# Altium project ECE453-F22-MCU.PrjPcb (part 2 of 3)

## Sheet 03_Power_Delivery.SchDoc
size A
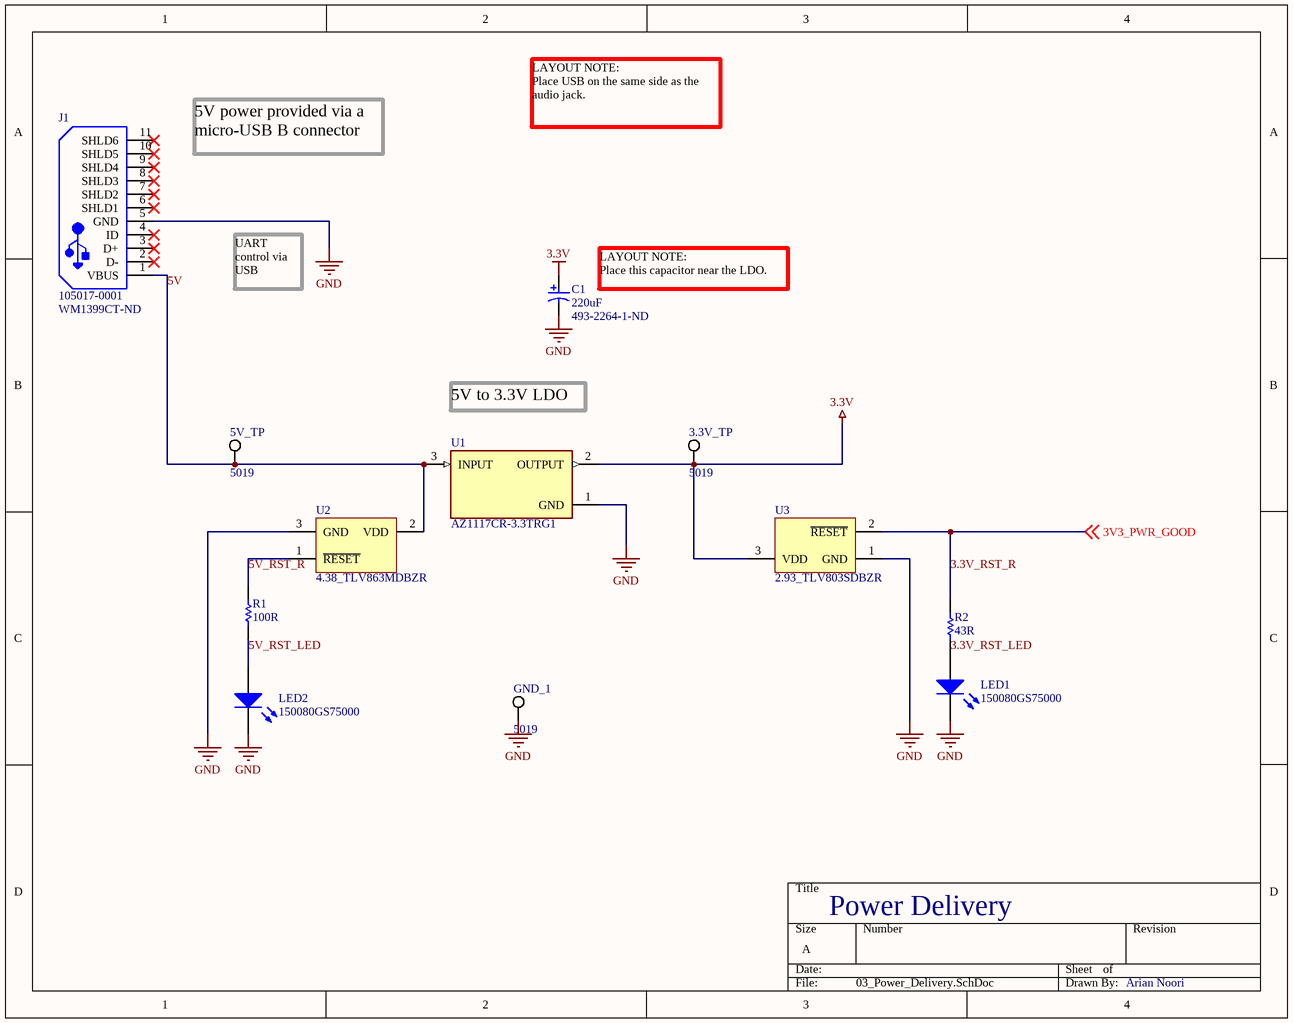
[diagram p2: 03_Power_Delivery.SchDoc]

### Parts
3.3V_TP  5019  [KSTN-5019_V]
5V_TP  5019  [KSTN-5019_V]
C1  220uF  Supplier Part Number 1: 493-2264-1-ND  [NIC-CAPA2-6.3X7.7_V]
GND_1  5019  [KSTN-5019_V]
J1  105017-0001  Supplier Part Number 1: WM1399CT-ND  [USB-MICRO-B_V]
LED1  150080GS75000  [0805_A]
LED2  150080GS75000  [0805_A]
R1  100R  [RESC2013X60X35ML10T20]
R2  43R  [RESC2013X60X35LL10T20]
U1  AZ1117CR-3.3TRG1  [FP-SOT89-MFG]
U2  4.38_TLV863MDBZR  [DBZ0003A_N]
U3  2.93_TLV803SDBZR  [DBZ0003A_M]

### Nets
3.3V: 3.3V_TP.1 C1.1 U1.2(OUTPUT) U3.3(VDD)
GND: C1.2 GND_1.1 J1.5(GND) LED1.1(K) LED2.1(K) U1.1(GND) U2.3(GND) U3.1(GND)
3.3V_RST_LED: LED1.2(A) R2.1
3.3V_RST_R: R2.2 U3.2(~{RESET}) ; off-sheet 3V3_PWR_GOOD  [also labelled 3V3_PWR_GOOD]
5V: 5V_TP.1 J1.1(VBUS) U1.3(INPUT) U2.2(VDD)
5V_RST_LED: LED2.2(A) R1.1
5V_RST_R: R1.2 U2.1(~{RESET})

Not connected (* = marked no-connect by the designer): J1 2(D-)* 3(D+)* 4(ID)* 6(SHLD1)* 7(SHLD2)* 8(SHLD3)* 9(SHLD4)* 10(SHLD5)* 11(SHLD6)*

### Notes on the sheet
- 5V power provided via a micro-USB B connector
- LAYOUT NOTE:
  Place USB on the same side as the audio jack.
- UART control via USB
- (near C1) LAYOUT NOTE:
  Place this capacitor near the LDO.
- 5V to 3.3V LDO
- Power Delivery
- Arian Noori

### Library data of the parts
3.3V_TP 5V_TP GND_1 = CMP-1672-00008-1: Test Point, 1 Position SMD, RoHS, Tape and Reel; Manufacturer: Keystone Electronics; ComponentLink1Description: Manufacturer URL; Package Quantity: 1000; DatasheetVersion: 03/2014; Packaging: Tape and Reel; ComponentLink2URL: http://www.keyelco.com/product-pdf.cfm?p=1357; ComponentLink1URL: http://www.keyelco.com/; Mount: Surface Mount; Contact Plating: Silver; PackageDescription: 1-Pin Surface Mount Device, Body 3.81 x 2.03 mm; Pins: 1; RoHSCompliant: True; Mounting Technology: Surface Mount; ComponentLink2Description: Datasheet; PackageReference: 5019; Supplier 1: Digi-Key; Manufacturer Part Number: 5019; RoHS: Yes; Category: Connectors; Stock 1: 1306897; Pricing 1: 1=0.34000, 25=0.27360, 100=0.22340, 250=0.20064, 500=0.19152 (USD); Number of Pins: 1; Material: Bronze; Contact Material: Bronze; Termination: SMD/SMT; Series: 5019; Height: 0.09inch; REACH SVHC: No SVHC; RoHS Compliant: Yes; Lead Free: Lead Free; ComponentLink3URL: https://datasheet.ciiva.com/16318/m60-2p61-16318395.pdf?src-supplier=Future+Electronics; ComponentLink3Description: https://datasheet.ciiva.com/16318/m60-2p61-16318395.pdf?src-supplier=Future+Electronics; ComponentLink4URL: https://datasheet.ciiva.com/16885/70182998-16885945.pdf?src-supplier=Allied+Electronics; ComponentLink4Description: https://datasheet.ciiva.com/16885/70182998-16885945.pdf?src-supplier=Allied+Electronics; ComponentLink5URL: https://datasheet.ciiva.com/14848/m60-2p61-14848437.pdf?src-supplier=Digi-Key; ComponentLink5Description: https://datasheet.ciiva.com/14848/m60-2p61-14848437.pdf?src-supplier=Digi-Key; ComponentLink6URL: https://datasheet.ciiva.com/14848/m60-2p61-14848438.pdf?src-supplier=Digi-Key; ComponentLink6Description: https://datasheet.ciiva.com/14848/m60-2p61-14848438.pdf?src-supplier=Digi-Key; ComponentLink7URL: https://datasheet.ciiva.com/14848/m60-2p61-14848439.pdf?src-supplier=Digi-Key; ComponentLink7Description: https://datasheet.ciiva.com/14848/m60-2p61-14848439.pdf?src-supplier=Digi-Key
C1 = CMP-0687-00060-1: Aluminum Electrolytic Capacitor, UD Series, Low Impedance, 220 uF, 16 V, + / - 20%, -55 to 105 degC, Chip Type, 6.3 x 7.7 mm D x L, Pb-Free, Reel; PartNumber: UUD1C221MCL1GS; Manufacturer: Nichicon; Impedance: 0.34 Ohm; Tolerance Rated Capacitance: -20 to 20%; Rated Voltage: 16 V; Endurance Time: 2000 h; Rated Ripple Current (at 100kHz): 280 mA; Packing: Dia382mm Reel; Description: Aluminum Electrolytic Capacitor, 220uF 16 V, UD Series 2000h 6.3 (Dia.) x 7.7mm; Dielectric Material: Aluminium; Ripple Current: 280mA; Voltage Rating (DC): 16V; Leakage Current: 3uA; Life (Hours): 2000Hour; Dissipation Factor: 0.2%; Lead Diameter: 0.8mm; PackageReference: CAPAE-D6.3H7.7; DatasheetVersion: 08/2012; Rated Capacitance: 220 uF; ComponentLink1URL: http://www.nichicon.co.jp/; ComponentLink3URL: http://products.nichicon.co.jp/en/pdf/XJA043/e-ud.pdf; PackageDescription: 2-Pin Surface Mount Device, Diameter 6.3 mm, Height 7.7 mm, Pitch 5.4 mm; ComponentLink3Description: Package Specification; Length: 7.7 mm; RoHS: TRUE; Mounting Technology: Surface Mount; ComponentLink2Description: Datasheet; ComponentLink2URL: http://products.nichicon.co.jp/en/pdf/XJA043/e-ud.pdf; Diameter: 6.3 mm; ComponentLink1Description: Manufacturer URL; Supplier 1: Digi-Key; Manufacturer Part Number: UUD1C221MCL1GS; Category: Aluminum Electrolytic Capacitors; Stock 1: 25833; Pricing 1: 1=0.46000, 10=0.32000, 50=0.22420, 100=0.19220 (USD); Case/Package: Radial; Number of Pins: 2; Min Operating Temperature: -55°C; Max Operating Temperature: 105°C; Tolerance: 20%; Ripple Current (AC): 280mA; Package Quantity: 1; Packaging: Tape and Reel; Capacitance: 220uF; Voltage Rating: 16V; Termination: SMD/SMT; Voltage: 16V; Series: UD; Construction: Cylindrical; Height: 7.7mm; Lead Pitch: 2.2mm; Height - Seated (Max): 0.303inch; Radiation Hardening: No; REACH SVHC: No SVHC; Lead Free: Lead Free; RoHS Compliant: Yes; ComponentLink4URL: https://datasheet.ciiva.com/97/e-ud-97205.pdf?src-supplier=Digi-Key; ComponentLink4Description: https://datasheet.ciiva.com/97/e-ud-97205.pdf?src-supplier=Digi-Key; ComponentLink5URL: https://datasheet.ciiva.com/97/e-ud-97206.pdf?src-supplier=Digi-Key; ComponentLink5Description: https://datasheet.ciiva.com/97/e-ud-97206.pdf?src-supplier=Digi-Key; ComponentLink6URL: https://datasheet.ciiva.com/97/e-ud-97207.pdf?src-supplier=Digi-Key; ComponentLink6Description: https://datasheet.ciiva.com/97/e-ud-97207.pdf?src-supplier=Digi-Key; ComponentLink7URL: https://datasheet.ciiva.com/11685/e-ud-11685974.pdf?src-supplier=Avnet; ComponentLink7Description: https://datasheet.ciiva.com/11685/e-ud-11685974.pdf?src-supplier=Avnet; ComponentLink8URL: https://datasheet.ciiva.com/5361/e-ud-5361934.pdf?src-supplier=Mouser; ComponentLink8Description: https://datasheet.ciiva.com/5361/e-ud-5361934.pdf?src-supplier=Mouser; ComponentLink9URL: https://datasheet.ciiva.com/16373/e-ud-16373647.pdf?src-supplier=Future+Electronics; ComponentLink9Description: https://datasheet.ciiva.com/16373/e-ud-16373647.pdf?src-supplier=Future+Electronics; ComponentLink10URL: https://datasheet.ciiva.com/7781/e-ud-7781693.pdf?src-supplier=Element14; ComponentLink10Description: https://datasheet.ciiva.com/7781/e-ud-7781693.pdf?src-supplier=Element14
J1 = CMP-2000-05827-1: Micro-USB B Receptacle, Right Angle, Bottom Mount, Surface Mount, with Solder Tabs, -30 to 85 degC, 5-Pin USB, RoHS, Tape and Reel; Manufacturer: Molex; Featured Product: Micro-USBConnectorsUSBConnectors; Other Names: WM1399DKR; Package Version: Rev. F, 12/2012; Number of Contacts: 5; Connector Type: USB-microB; Catalog Drawings: 1050170001; 3D Model: 105017-0001.stp; Mating Products: WM17145-ND-CABLEMICROUSBBTOSTDA1.0MWM17147-ND-CABLEMICROUSBBTOSTDA2.0MWM17146-ND-CABLEMICROUSBBTOSTDA1.5M; PCN Assembly/Origin: ResinSupplier21/Oct/2015; Voltage - Max: 30V; Online Catalog: Molex-MicroUSB; USB Standard: USB 2.0; Current Rating: 1.8A; Number of Ports: 1; Mating Cycles: 10000; Shielding: Shielded; Pitch: 0.65mm; Manufacturer URL: http://www.molex.com/; Package Description: 5-Leads USB, Micro B, Body 7.5 x 5 mm, Pitch 0.65 mm; Datasheet URL: http://www.molex.com/elqNow/elqRedir.htm?ref=http://www.molex.com/webdocs/datasheets/pdf/en-us/1050170001_IO_CONNECTORS.pdf; Ingress Protection: -; Datasheet Version: 03/2016; Mounting Type: BoardCutout,SurfaceMount,RightAngle; Circuits: 5; Standard Package: 1; Package Reference: MICRO-B; Package URL: http://www.molex.com/pdm_docs/sd/1050170001_sd.pdf; Category: Connectors,Interconnects; Series: -; RoHS Information: 1050170001CertofCompliance; Features: Shielded,SolderRetention; Family: USB,DVI,HDMIConnectors; Specifications: -; Gender: Receptacle; Packaging: Digi-Reel®; Mounting Technology: SurfaceMount; Supplier 1: Digi-Key; Manufacturer Part Number: 1050170001; RoHS: Yes; Stock 1: 49105; Pricing 1: 1=1.01000, 10=0.84000, 100=0.69990, 1000=0.55994 (USD); Mount: Surface Mount,Through Hole,Horizontal; Contact Plating: Gold; Contact Material: Copper Alloy,Copper; Number of Terminals/Pins: 5; Housing Material: Polymer; Insulation Color: Black; Min Operating Temperature: -30°C; Max Operating Temperature: 85°C; Orientation: Right Angle; Termination: Solder; Voltage Rating (AC): 30V; Max Voltage Rating (AC): 30V; Voltage Rating: 30V; Package Quantity: 2000; Number of Positions: 5; Number of Circuits: 5; Length: 8.2mm; Depth: 7.5mm; Radiation Hardening: No; REACH SVHC: Unknown; RoHS Compliant: Yes; Flammability Rating: UL94 V-0; Halogen Free: Low Halogen; ComponentLink1URL: https://datasheet.ciiva.com/30165/235271050170001-io-nectors-30165183.pdf?src-supplier=Onlinecomponents.com; ComponentLink1Description: https://datasheet.ciiva.com/30165/235271050170001-io-nectors-30165183.pdf?src-supplier=Onlinecomponents.com; ComponentLink2URL: https://datasheet.ciiva.com/8015/1631959-8015288.pdf?src-supplier=Element14; ComponentLink2Description: https://datasheet.ciiva.com/8015/1631959-8015288.pdf?src-supplier=Element14; ComponentLink3URL: https://datasheet.ciiva.com/22654/1688140-22654924.pdf?src-supplier=Element14; ComponentLink3Description: https://datasheet.ciiva.com/22654/1688140-22654924.pdf?src-supplier=Element14; ComponentLink4URL: https://datasheet.ciiva.com/3094/1050170001-io-connectors-3094416.pdf?src-supplier=Avnet; ComponentLink4Description: https://datasheet.ciiva.com/3094/1050170001-io-connectors-3094416.pdf?src-supplier=Avnet; ComponentLink5URL: https://datasheet.ciiva.com/4598/1050170001-io-connectors-152207-4598759.pdf?src-supplier=Mouser; ComponentLink5Description: https://datasheet.ciiva.com/4598/1050170001-io-connectors-152207-4598759.pdf?src-supplier=Mouser; ComponentLink6URL: https://datasheet.ciiva.com/851/1050170001-sd-851276.pdf?src-supplier=Digi-Key; ComponentLink6Description: https://datasheet.ciiva.com/851/1050170001-sd-851276.pdf?src-supplier=Digi-Key; ComponentLink7URL: https://datasheet.ciiva.com/851/1050170001-sd-851277.pdf?src-supplier=Digi-Key; ComponentLink7Description: https://datasheet.ciiva.com/851/1050170001-sd-851277.pdf?src-supplier=Digi-Key; ComponentLink8URL: https://datasheet.ciiva.com/851/1050170001-sd-851278.pdf?src-supplier=Digi-Key; ComponentLink8Description: https://datasheet.ciiva.com/851/1050170001-sd-851278.pdf?src-supplier=Digi-Key; ComponentLink9URL: https://datasheet.ciiva.com/16668/1050170001-io-connectors-16668598.pdf?; ComponentLink9Description: https://datasheet.ciiva.com/16668/1050170001-io-connectors-16668598.pdf?
LED1 LED2 = CMP-1426-00007-1: SMD mono-color Chip LED, WL-SMCW, Green; Manufacturer: Wuerth Elektronik; Manufacturer 1: Wurth Electronics; Viewing Angle: 140°; Lens Style: Clear,Rectangular; Luminous Intensity: 450mcd; Forward Voltage: 3.2V; Wavelength: 520nm; Forward Current: 30mA; Test Current: 20mA; PackageReference: 0805_A; Color: Green; PartNumber: 150080GS75000; ComponentLink2URL: http://katalog.we-online.com/led/datasheet/150080GS75000.pdf; ComponentLink1URL: http://www.we-online.com; ComponentLink1Description: Manufacturer URL; ComponentLink2Description: Datasheet; Supplier 1: Digi-Key; Supplier Part Number 1: 732-4983-1-ND; Manufacturer Part Number 1: 150080GS75000; RoHS: Yes; Category: LEDs; Stock 1: 95801; Pricing 1: 1=0.19000, 50=0.17600, 100=0.15100, 500=0.13100 (USD); Mount: Surface Mount; Case/Package: 0805; Case Code (Metric): 2012; Case Code (Imperial): 0805; Min Operating Temperature: -40°C; Max Operating Temperature: 85°C; Package Quantity: 4000; Packaging: Cut Tape; Dominant Wavelength: 520nm; Length: 2mm; Width: 1.25mm; Height: 0.7mm; REACH SVHC: Unknown; RoHS Compliant: Yes; ComponentLink3URL: https://datasheet.ciiva.com/29563/150080gs75000-29563008.pdf?src-supplier=Digi-Key; ComponentLink3Description: https://datasheet.ciiva.com/29563/150080gs75000-29563008.pdf?src-supplier=Digi-Key; ComponentLink4URL: https://datasheet.ciiva.com/29279/759434-da-01-en-chipled-0805-w-kl-gruen-150080gs75000-29279039.pdf?src-supplier=Conrad; ComponentLink4Description: https://datasheet.ciiva.com/29279/759434-da-01-en-chipled-0805-w-kl-gruen-150080gs75000-29279039.pdf?src-supplier=Conrad
R1 = CMP-2100-03669-1: Chip Resistor, 100 Ohm, +/-1%, 0.125 W, -55 to 155 degC, 0805 (2012 Metric), RoHS, Tape and Reel; Manufacturer: Yageo; Manufacturer Part Number: RC0805FR-07100RL; Power Rating: 125mW; Resistance: 100Ohm; Voltage Rating: 150V; Tolerance: 1%; Temperature Coefficient: 100ppm/degreesC; Application(s): HIGH RELIABILITY; Length: 2mm; Package Description: 2-Pin Surface Mounted Device, Body 2 x 1.25 mm; Case Code (Imperial): 0805; Number of Pins: 2; Termination: SMD/SMT; Lead Pitch: 0.4mm; Package Quantity: 1; Height: 0.024inch; Case Code (Metric): 2012; Number of Terminations: 2; Datasheet Version: Rev. 5, 10/2016; Lead Free: LeadFree; Package Reference: 0805; Composition: ThickFilm; REACH SVHC: Unknown; Voltage Rating (DC): 150V; Min Operating Temperature: -55degC; Packaging: TapeandReel; Military Standard: Not; Case/Package: 0805; Datasheet URL: http://www.yageo.com/NewPortal/yageodocoutput?fileName=/pdf/R-Chip/PYu-RC_Group_51_RoHS_L_5.pdf; Max Operating Temperature: 155degC; Manufacturer URL: http://www.yageo.com/; Max Power Dissipation: 125mW; Width: 0.049inch; Depth: 1.25mm; RoHSCompliant: true; Supplier 1: Digi-Key; RoHS: Yes; Category: Chip SMD Resistors; Stock 1: 3207618; Pricing 1: 1=0.10000, 10=0.03700, 100=0.01510, 1000=0.00680, 2500=0.00590 (USD); Weight: 0.000917oz; Series: RC; Resistor Type: Thick Film; Technology: THICK FILM; Features: Moisture Resistant; Type: General Purpose; RoHS Compliant: Yes; ComponentLink1URL: https://datasheet.ciiva.com/11808/0900766b8106beab-11808877.pdf?src-supplier=RSComponents; ComponentLink1Description: https://datasheet.ciiva.com/11808/0900766b8106beab-11808877.pdf?src-supplier=RSComponents; ComponentLink2URL: https://datasheet.ciiva.com/7941/1697719-7941680.pdf?src-supplier=Element14; ComponentLink2Description: https://datasheet.ciiva.com/7941/1697719-7941680.pdf?src-supplier=Element14; ComponentLink3URL: https://datasheet.ciiva.com/7941/1686128-7941679.pdf?src-supplier=Element14; ComponentLink3Description: https://datasheet.ciiva.com/7941/1686128-7941679.pdf?src-supplier=Element14; ComponentLink4URL: https://datasheet.ciiva.com/7660/38627-7660797.pdf?src-supplier=Element14; ComponentLink4Description: https://datasheet.ciiva.com/7660/38627-7660797.pdf?src-supplier=Element14; ComponentLink5URL: https://datasheet.ciiva.com/22747/444164-22747535.pdf?src-supplier=Element14; ComponentLink5Description: https://datasheet.ciiva.com/22747/444164-22747535.pdf?src-supplier=Element14; ComponentLink6URL: https://datasheet.ciiva.com/46447/444164-46447562.pdf?src-supplier=Element14; ComponentLink6Description: https://datasheet.ciiva.com/46447/444164-46447562.pdf?src-supplier=Element14; ComponentLink7URL: https://datasheet.ciiva.com/2456/pyu-r-int-thick-7-2456988.pdf?src-supplier=Digi-Key; ComponentLink7Description: https://datasheet.ciiva.com/2456/pyu-r-int-thick-7-2456988.pdf?src-supplier=Digi-Key; ComponentLink8URL: https://datasheet.ciiva.com/2456/pyu-r-int-thick-7-2456989.pdf?src-supplier=Digi-Key; ComponentLink8Description: https://datasheet.ciiva.com/2456/pyu-r-int-thick-7-2456989.pdf?src-supplier=Digi-Key; ComponentLink9URL: https://datasheet.ciiva.com/2456/pyu-r-int-thick-7-2456987.pdf?src-supplier=Digi-Key; ComponentLink9Description: https://datasheet.ciiva.com/2456/pyu-r-int-thick-7-2456987.pdf?src-supplier=Digi-Key; ComponentLink10URL: https://datasheet.ciiva.com/17082/rc0805-17082697.pdf?src-supplier=Future+Electronics; ComponentLink10Description: https://datasheet.ciiva.com/17082/rc0805-17082697.pdf?src-supplier=Future+Electronics
R2 = CMP-2001-01384-1: RES 43 OHM 1/8W .5% SMD 0805; Part Number: RC0805JR-0743RL; Manufacturer: Yageo; Tolerance: 5%; Temperature Coefficient: 100ppm/°C; Max Power Dissipation: 125mW; Voltage Rating: 150V; Supplier 1: Digi-Key; Manufacturer Part Number: RC0805JR-0743RL; RoHS: Yes; Category: Chip SMD Resistors; Stock 1: 8138; Pricing 1: 1=0.10000, 10=0.03200, 100=0.01300, 1000=0.00584, 2500=0.00507 (USD); Case/Package: 0805; Case Code (Imperial): 0805; Case Code (Metric): 2012; Contact Plating: Tin,Matte; Size Code: 0805; Min Operating Temperature: -55°C; Max Operating Temperature: 155°C; Resistance: 43R; Packaging: Tape and Reel; Series: RC; Number of Terminations: 2; Power Rating: 125mW; Resistor Type: Thick Film; Termination: SMD/SMT; Voltage Rating (DC): 150V; Features: Moisture Resistant; Construction: Rectangular; Length: 2mm; Width: 1.25mm; Height: 0.5mm; Depth: 1.25mm; Radiation Hardening: No; RoHS Compliant: Yes; Lead Free: Lead Free; Military Standard: Not; ComponentLink1URL: https://datasheet.ciiva.com/12560/rc0805-257173-12560726.pdf?src-supplier=Mouser; ComponentLink1Description: https://datasheet.ciiva.com/12560/rc0805-257173-12560726.pdf?src-supplier=Mouser; ComponentLink2URL: https://datasheet.ciiva.com/16745/rc0805-16745692.pdf?src-supplier=Future+Electronics; ComponentLink2Description: https://datasheet.ciiva.com/16745/rc0805-16745692.pdf?src-supplier=Future+Electronics
U1 = CMP-12756-000007-1: IC REG LINEAR 3.3V 800MA SOT89; Manufacturer: Diodes Inc.; Nominal Supply Current: 4mA; Output Type: Fixed; Accuracy Percentage: 1%; Max Junction Temp: +125°C; Max Supply Voltage: 15V; Number Of Outputs: 1; Output Current: 1.35A; Dropout Voltage: 1.2V; Min Current Limit: 1A; Polarity: Positive; Reference Voltage: 1.262V; Power Supply Rejection Ratio (PSRR): 70dB; Device Class L1: Integrated Circuits (ICs); ComponentLink2URL: https://www.diodes.com/assets/Datasheets/AZ1117C.pdf; Temperature Range High: +125°C; Octopart: https://octopart.com/az1117cr-3.3trg1-diodes+inc.-30954805; Output Voltage: 3.3V; Automotive: No; RoHS: TRUE; Temperature Range Low: -20°C; Package: SOT89; Height: 1.6mm; Mouser Description: DiodesZetex AZ1117CR-3.3TRG1, LDO Regulator, 800mA, 3.3 V, ±1% 3-Pin, SOT-89; Manufacturer Part Number: AZ1117CR-3.3TRG1; ComponentLink2Description: Datasheet; Device Class L2: Power Management ICs; Lead Free: Yes; Device Class L3: Voltage Regulators - Linear; Category: IC; Temperature: -20°C to +125°C; Footprint Url: https://www.diodes.com/assets/Package-Files/SOT89.pdf; Digikey Description: IC REG LINEAR 3.3V 800MA SOT89; Supplier 1: Digi-Key; Stock 1: 15482; Pricing 1: 1=0.44000, 10=0.33300, 25=0.30040, 100=0.20740, 250=0.17468, 500=0.14194 (USD); Mount: Surface Mount; Case/Package: SOT-89; Number of Pins: 3; Weight: 0.004603oz; Min Operating Temperature: -20°C; Max Operating Temperature: 125°C; Max Input Voltage: 15V; Package Quantity: 1000; Packaging: Tape and Reel; Max Output Current: 1.35A; Number of Regulators: 1; Quiescent Current: 4mA; Accuracy: 1%; Length: 4.6mm; Width: 2.6mm; ComponentLink1URL: https://datasheet.ciiva.com/29568/az1117c-29568862.pdf?src-supplier=Digi-Key; ComponentLink1Description: https://datasheet.ciiva.com/29568/az1117c-29568862.pdf?src-supplier=Digi-Key; ComponentLink3URL: https://datasheet.ciiva.com/30016/az1117c-30016678.pdf?src-supplier=Avnet; ComponentLink3Description: https://datasheet.ciiva.com/30016/az1117c-30016678.pdf?src-supplier=Avnet
U2 = CMP-0332-00606-2: Voltage Supervisor with Active-Low, Open-Drain Reset, 1 Supply Monitored, -40 to 125 degC, 3-pin SOT-23 (DBZ), Green (RoHS & no Sb/Br); Manufacturer: Texas Instruments; Reset Threshold Accuracy(%): 2; Time Delay(ms): 200; Iq(Typ)(uA): 9; Threshold Voltage 1 (typ)(Typ)(V): 4.38; # of Supplies Monitored: 1; VCC(Max)(V): 6; VCC(Min)(V): 1.1; SubFamily: Supervisor and Reset IC; Rating: Catalog; Max Supply Voltage: 6V; Min Supply Voltage: 1.1V; Nominal Supply Current: 30uA; Operating Supply Current: 20uA; Reset: Active Low; Reset Timeout: 120ms; Threshold Voltage: 4.38V; Max Reset Threshold Voltage: 4.48V; Min Reset Threshold Voltage: 4.28V; Quiescent Current: 9uA; DatasheetVersion: SBVS157B; Code_JEDEC: TO-236-AB; PackageReference: DBZ0003A; Mounting Technology: Surface Mount; ComponentLink1Description: Datasheet; ComponentLink1URL: http://www.ti.com/general/docs/lit/getliterature.tsp?genericPartNumber=TLV863M&fileType=pdf; PackageDescription: 3-Pin Plastic Small-Outline Package, 0.95 mm Pitch, 2.4 mm Lead Span; Output Driver Type / Reset Output: Active-low, Open-drain; PackageVersion: revB, Apr-2005; PartNumber: TLV863MDBZR; Supplier 1: Digi-Key; Manufacturer Part Number: TLV863MDBZR; RoHS: Yes; Category: Voltage Supervisors; Stock 1: 1146; Pricing 1: 1=0.90000, 10=0.80100, 25=0.76000, 100=0.62410, 250=0.58344, 500=0.51558, 1000=0.40960 (USD); Case/Package: SOT-23-3; Number of Pins: 3; Min Operating Temperature: -40°C; Max Operating Temperature: 125°C; Packaging: Tape and Reel; Package Quantity: 1; Number of Voltages Monitored: 1; Number of Elements: 1; Max Supply Current: 30uA; Watchdog Timer: No; Series: -; Supply Current: 30uA; Radiation Hardening: No; Lead Free: Lead Free; RoHS Compliant: Yes; ComponentLink2URL: https://datasheet.ciiva.com/14203/tlv863m-14203620.pdf?src-supplier=Avnet; ComponentLink2Description: https://datasheet.ciiva.com/14203/tlv863m-14203620.pdf?src-supplier=Avnet; ComponentLink3URL: https://datasheet.ciiva.com/1979/tlv863m-1979819.pdf?src-supplier=Digi-Key; ComponentLink3Description: https://datasheet.ciiva.com/1979/tlv863m-1979819.pdf?src-supplier=Digi-Key; ComponentLink4URL: https://datasheet.ciiva.com/1979/tlv863m-1979818.pdf?src-supplier=Digi-Key; ComponentLink4Description: https://datasheet.ciiva.com/1979/tlv863m-1979818.pdf?src-supplier=Digi-Key; ComponentLink5URL: https://datasheet.ciiva.com/1979/tlv863m-1979820.pdf?src-supplier=Digi-Key; ComponentLink5Description: https://datasheet.ciiva.com/1979/tlv863m-1979820.pdf?src-supplier=Digi-Key
U3 = CMP-0332-00609-2: Voltage Supervisor with Active-Low, Open Drain Reset, 1 Supply Monitored, -40 to 125 degC, 3-pin SOT-23 (DBZ), Green (RoHS & no Sb/Br); Manufacturer: Texas Instruments; Time Delay(ms): 200; Output Driver Type / Reset Output: Active-low, Open-drain; Rating: Catalog; VCC(Min)(V): 1.1; VCC(Max)(V): 6; Threshold Voltage 1 (typ)(Typ)(V): 2.93; SubFamily: Supervisor and Reset IC; # of Supplies Monitored: 1; Iq(Typ)(uA): 9; Reset Threshold Accuracy(%): 2; Max Supply Voltage: 6V; Min Supply Voltage: 1.1V; Nominal Supply Current: 30uA; Operating Supply Current: 20uA; Reset: Active Low; Reset Timeout: 120ms; Threshold Voltage: 2.93V; Max Reset Threshold Voltage: 2.99V; Min Reset Threshold Voltage: 2.87V; Quiescent Current: 9uA; PackageDescription: 3-Pin Plastic Small-Outline Package, 0.95 mm Pitch, 2.4 mm Lead Span; Mounting Technology: Surface Mount; ComponentLink1Description: Datasheet; Code_JEDEC: TO-236-AB; PackageReference: DBZ0003A; PartNumber: TLV803SDBZR; PackageVersion: revB, Apr-2005; DatasheetVersion: SBVS157B; ComponentLink1URL: http://www.ti.com/general/docs/lit/getliterature.tsp?genericPartNumber=TLV803S&fileType=pdf; Supplier 1: Digi-Key; Manufacturer Part Number: TLV803SDBZR; RoHS: Yes; Category: Voltage Supervisors; Stock 1: 24687; Pricing 1: 1=0.95000, 10=0.83600, 25=0.78520, 100=0.64100, 250=0.59536, 500=0.50668, 1000=0.40534 (USD); Mount: Surface Mount; Case/Package: SOT-23; Number of Pins: 3; Min Operating Temperature: -40°C; Max Operating Temperature: 125°C; Packaging: Tape and Reel; Package Quantity: 1; Type: Simple Reset/Power-On Reset; Number of Voltages Monitored: 1; Number of Elements: 1; Max Supply Current: 30uA; Watchdog Timer: No; Series: -; Supply Current: 30uA; Radiation Hardening: No; REACH SVHC: No SVHC; Lead Free: Lead Free; RoHS Compliant: Yes; ComponentLink2URL: https://datasheet.ciiva.com/15105/getdatasheetpartid-544055-15105605.pdf?src-supplier=Verical; ComponentLink2Description: https://datasheet.ciiva.com/15105/getdatasheetpartid-544055-15105605.pdf?src-supplier=Verical; ComponentLink3URL: https://datasheet.ciiva.com/1979/tlv803m-1979838.pdf?src-supplier=Digi-Key; ComponentLink3Description: https://datasheet.ciiva.com/1979/tlv803m-1979838.pdf?src-supplier=Digi-Key; ComponentLink4URL: https://datasheet.ciiva.com/1979/tlv803m-1979837.pdf?src-supplier=Digi-Key; ComponentLink4Description: https://datasheet.ciiva.com/1979/tlv803m-1979837.pdf?src-supplier=Digi-Key; ComponentLink5URL: https://datasheet.ciiva.com/1979/tlv803m-1979839.pdf?src-supplier=Digi-Key; ComponentLink5Description: https://datasheet.ciiva.com/1979/tlv803m-1979839.pdf?src-supplier=Digi-Key; ComponentLink6URL: https://datasheet.ciiva.com/14203/tlv863m-14203548.pdf?src-supplier=Avnet; ComponentLink6Description: https://datasheet.ciiva.com/14203/tlv863m-14203548.pdf?src-supplier=Avnet

## Sheet 04_LCD.SchDoc
size A
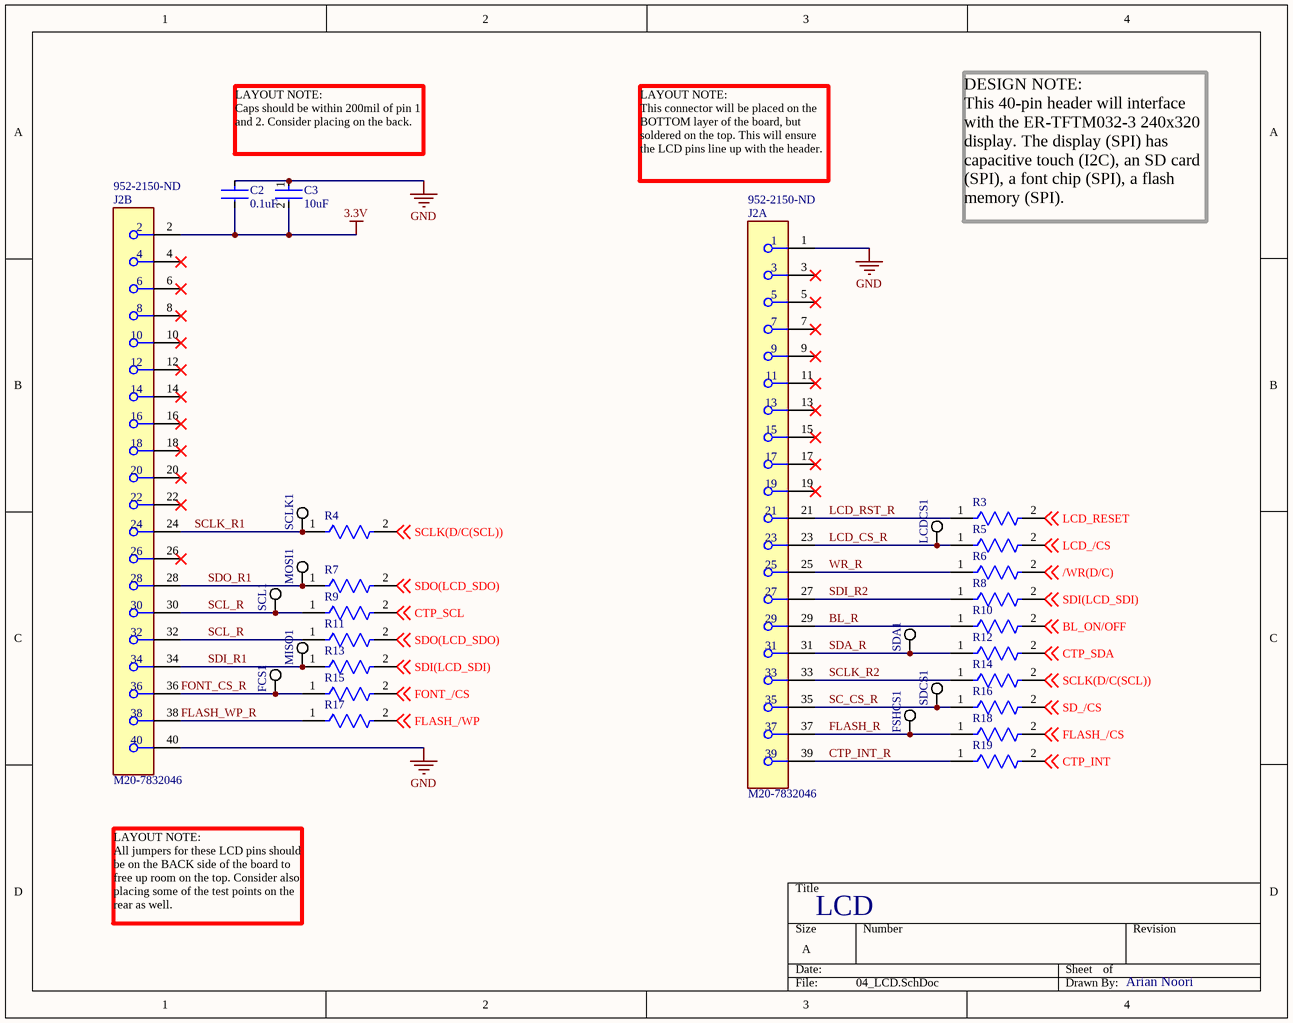
[diagram p3: 04_LCD.SchDoc]

### Parts
C2  0.1uF  [FP-CL21-IPC_C]
C3  value 10uF  [FP-C0805C-DG-MFG]  (hidden comment: C0805C106K8PACTU)
FCS1  5019  [KSTN-5019_V]  (value not drawn)
FSHCS1  5019  [KSTN-5019_V]  (value not drawn)
J2  M20-7832046  Supplier Part Number 1: 952-2150-ND  [FP-M20-7832046-MFG]  (parts A,B of 2)
LCDCS1  5019  [KSTN-5019_V]  (value not drawn)
MISO1  5019  [KSTN-5019_V]  (value not drawn)
MOSI1  5019  [KSTN-5019_V]  (value not drawn)
R3  (no value)  [FP-RC0805-MFG]
R4  (no value)  [FP-RC0805-MFG]
R5  (no value)  [FP-RC0805-MFG]
R6  (no value)  [FP-RC0805-MFG]
R7  (no value)  [FP-RC0805-MFG]
R8  (no value)  [FP-RC0805-MFG]
R9  (no value)  [FP-RC0805-MFG]
R10  (no value)  [FP-RC0805-MFG]
R11  (no value)  [FP-RC0805-MFG]
R12  (no value)  [FP-RC0805-MFG]
R13  (no value)  [FP-RC0805-MFG]
R14  (no value)  [FP-RC0805-MFG]
R15  (no value)  [FP-RC0805-MFG]
R16  (no value)  [FP-RC0805-MFG]
R17  (no value)  [FP-RC0805-MFG]
R18  (no value)  [FP-RC0805-MFG]
R19  (no value)  [FP-RC0805-MFG]
SCL1  5019  [KSTN-5019_V]  (value not drawn)
SCLK1  5019  [KSTN-5019_V]  (value not drawn)
SDA1  5019  [KSTN-5019_V]  (value not drawn)
SDCS1  5019  [KSTN-5019_V]  (value not drawn)

### Nets
3.3V: C2.2 C3.2 J2.2
GND: C2.1 C3.1 J2.1 J2.40
/WR(D/C): R6.2 ; off-sheet /WR(D/C)
BL_ON/OFF: R10.2 ; off-sheet BL_ON/OFF
BL_R: J2.29 R10.1
CTP_INT: R19.2 ; off-sheet CTP_INT
CTP_INT_R: J2.39 R19.1
CTP_SCL: R9.2 ; off-sheet CTP_SCL
CTP_SDA: R12.2 ; off-sheet CTP_SDA
FLASH_/CS: R18.2 ; off-sheet FLASH_/CS
FLASH_/WP: R17.2 ; off-sheet FLASH_/WP
FLASH_R: FSHCS1.1 J2.37 R18.1
FLASH_WP_R: J2.38 R17.1
FONT_/CS: R15.2 ; off-sheet FONT_/CS
FONT_CS_R: FCS1.1 J2.36 R15.1
LCD_/CS: R5.2 ; off-sheet LCD_/CS
LCD_CS_R: J2.23 LCDCS1.1 R5.1
LCD_RESET: R3.2 ; off-sheet LCD_RESET
LCD_RST_R: J2.21 R3.1
SC_CS_R: J2.35 R16.1 SDCS1.1
SCL_R: J2.30 J2.32 R9.1 R11.1 SCL1.1
SCLK(D/C(SCL)): R4.2 R14.2 ; off-sheet SCLK(D/C(SCL))
SCLK_R1: J2.24 R4.1 SCLK1.1
SCLK_R2: J2.33 R14.1
SD_/CS: R16.2 ; off-sheet SD_/CS
SDA_R: J2.31 R12.1 SDA1.1
SDI(LCD_SDI): R8.2 R13.2 ; off-sheet SDI(LCD_SDI)
SDI_R1: J2.34 MISO1.1 R13.1
SDI_R2: J2.27 R8.1
SDO(LCD_SDO): R7.2 R11.2 ; off-sheet SDO(LCD_SDO)
SDO_R1: J2.28 MOSI1.1 R7.1
WR_R: J2.25 R6.1

Not connected (* = marked no-connect by the designer): J2 3* 4* 5* 6* 7* 8* 9* 10* 11* 12* 13* 14* 15* 16* 17* 18* 19* 20* 22* 26*

### Notes on the sheet
- LAYOUT NOTE:
  Caps should be within 200mil of pin 1 and 2. Consider placing on the back.
- LAYOUT NOTE:
  This connector will be placed on the BOTTOM layer of the board, but soldered on the top. This will ensure the LCD pins line up with the header.
- DESIGN NOTE:
  This 40-pin header will interface with the ER-TFTM032-3 240x320 display. The display (SPI) has capacitive touch (I2C), an SD card (SPI), a font chip (SPI), a flash memory (SPI).
- LAYOUT NOTE:
  All jumpers for these LCD pins should be on the BACK side of the board to free up room on the top. Consider also placing some of the test points on the rear as well.
- LCD
- Arian Noori

### Library data of the parts
C2 = CMP-2000-05017-2: CL21 Series 0805 100nF 50V ±10% Tolerance X7R Multilayer Ceramic Chip Capacitor; Manufacturer: Samsung; Manufacturer Part Number: CL21B104KBCNNNC; Depth: 1.25mm; Height: 0.85mm; Width: 0.049inch; Tolerance: 10%; Case Code (Metric): 2012; Case Code (Imperial): 0805; Material: Ceramic; Thickness: 0.037inch; Min Operating Temperature: -55°C; Contact Plating: Tin; Length: 2mm; Mount: Surface Mount; Voltage Rating (DC): 50V; Lead Free: Lead Free; Dielectric: X7R; Radiation Hardening: No; Capacitance: 100nF; Voltage Rating: 50V; Case/Package: 0805; Packaging: Tape and Reel; Max Operating Temperature: 125°C; Voltage: 50V; Supplier 1: Digi-Key; RoHS: Yes; Category: Ceramic Capacitors; Stock 1: 4599648; Pricing 1: 1=0.10000, 10=0.04400, 50=0.02400, 100=0.01960, 500=0.01404, 1000=0.01103 (USD); Series: CL; Construction: Flat; RoHS Compliant: Yes; ComponentLink1URL: https://datasheet.ciiva.com/25710/cl21b104kbcnnnc-25710182.pdf?src-supplier=Digi-Key; ComponentLink1Description: https://datasheet.ciiva.com/25710/cl21b104kbcnnnc-25710182.pdf?src-supplier=Digi-Key; ComponentLink2URL: https://datasheet.ciiva.com/29199/454152-da-01-en-vs-kondensator-0805-29199814.pdf?src-supplier=Conrad; ComponentLink2Description: https://datasheet.ciiva.com/29199/454152-da-01-en-vs-kondensator-0805-29199814.pdf?src-supplier=Conrad
C3 = CMP-2007-03243-2: CAP CER 10UF 10V X5R 0805; Manufacturer: Kemet; 3DS Part Number: 220-00001; Tolerance: 10%; Temperature Coefficient: 15%; Material: Ceramic; Device Class L2: Capacitors; Device Class L1: Passive Components; ComponentLink2URL: https://content.kemet.com/datasheets/KEM_C1006_X5R_SMD.pdf; Height: 1.4mm; Lead Free: Yes; Manufacturer Part Number: C0805C106K8PACTU; Digikey Description: CAP CER 10UF 10V X5R 0805; Octopart: https://octopart.com/c0805c106k8pactu-kemet-98697; Capacitance: 10uF; Temperature Range Low: -55°C; Temperature: -55°C to +85°C; Automotive: No; Mouser Description: CAP CER 10UF 10V X5R 0805; Ipc Land Pattern Name: CAPC200125X125; Temperature Range High: +85°C; Voltage: 10V; RoHS: TRUE; Device Class L3: Ceramic Capacitors; ComponentLink2Description: Datasheet; Voltage Rating: 10V; Package: C0805C-DG; Temperature Characteristic: X5R; Category: Cap; Supplier 1: Digi-Key; Supplier Part Number 1: 399-C0805C106K8PAC7800CT-ND; Manufacturer 1: KEMET; Manufacturer Part Number 1: C0805C106K8PACTU; Stock 1: 8631846; Pricing 1: 1=0.14000, 10=0.10300, 50=0.05840, 100=0.04830, 500=0.03388, 1000=0.02805 (USD); Mount: Surface Mount; Case/Package: 0805; Number of Pins: 2; Case Code (Imperial): 0805; Case Code (Metric): 2012; Dielectric Material: Ceramic; Contact Plating: Tin,Matte; Min Operating Temperature: -55°C; Max Operating Temperature: 85°C; Packaging: Tape and Reel; Dielectric: X5R; Package Quantity: 1; Voltage Rating (DC): 10V; Series: C; Termination: SMD/SMT; Construction: Flat; Dissipation Factor: 10%; Length: 2mm; Width: 1.2mm; Depth: 1.25mm; Thickness: 0.055inch; Radiation Hardening: No; REACH SVHC: No SVHC; RoHS Compliant: Yes
FCS1 FSHCS1 LCDCS1 MISO1 MOSI1 SCL1 SCLK1 SDA1 SDCS1 = CMP-1672-00008-1: as 3.3V_TP on sheet 03_Power_Delivery; ComponentLink1Description: Manufacturer URL; Package Quantity: 1000; DatasheetVersion: 03/2014; Packaging: Tape and Reel; ComponentLink2URL: http://www.keyelco.com/product-pdf.cfm?p=1357; ComponentLink1URL: http://www.keyelco.com/; Mount: Surface Mount; Contact Plating: Silver; PackageDescription: 1-Pin Surface Mount Device, Body 3.81 x 2.03 mm; Pins: 1; RoHSCompliant: True; Mounting Technology: Surface Mount; ComponentLink2Description: Datasheet; PackageReference: 5019; Supplier 1: Digi-Key; Manufacturer Part Number: 5019; RoHS: Yes; Category: Connectors; Stock 1: 1295398; Pricing 1: 1=0.34000, 25=0.27360, 100=0.22340, 250=0.20064, 500=0.19152 (USD); Number of Pins: 1; Material: Bronze; Contact Material: Bronze; Termination: SMD/SMT; Series: 5019; Height: 0.09inch; REACH SVHC: No SVHC; RoHS Compliant: Yes; Lead Free: Lead Free; ComponentLink3URL: https://datasheet.ciiva.com/16318/m60-2p61-16318395.pdf?src-supplier=Future+Electronics; ComponentLink3Description: https://datasheet.ciiva.com/16318/m60-2p61-16318395.pdf?src-supplier=Future+Electronics; ComponentLink4URL: https://datasheet.ciiva.com/16885/70182998-16885945.pdf?src-supplier=Allied+Electronics; ComponentLink4Description: https://datasheet.ciiva.com/16885/70182998-16885945.pdf?src-supplier=Allied+Electronics; ComponentLink5URL: https://datasheet.ciiva.com/14848/m60-2p61-14848437.pdf?src-supplier=Digi-Key; ComponentLink5Description: https://datasheet.ciiva.com/14848/m60-2p61-14848437.pdf?src-supplier=Digi-Key; ComponentLink6URL: https://datasheet.ciiva.com/14848/m60-2p61-14848438.pdf?src-supplier=Digi-Key; ComponentLink6Description: https://datasheet.ciiva.com/14848/m60-2p61-14848438.pdf?src-supplier=Digi-Key; ComponentLink7URL: https://datasheet.ciiva.com/14848/m60-2p61-14848439.pdf?src-supplier=Digi-Key; ComponentLink7Description: https://datasheet.ciiva.com/14848/m60-2p61-14848439.pdf?src-supplier=Digi-Key
J2 = CMP-15831-000036-1: CONN RCPT 40POS 0.1 TIN PCB; Manufacturer: Harwin; Connector Type: Receptacle; Contact Resistance: 20mR; Pitch: 2.54mm; Insulation Resistance: 1MR; Mating Cycles: 50; Number of Contacts: 40; Max Current Rating: 3A; Hole Diameter: 0.8mm; Row Spacing: 0.1inch; Contact Material: Bronze; RoHS Compliant: Yes; Min Operating Temperature: -40°C; Mount: Through Hole; Gender: Receptacle; Depth: 5.04mm; Package Quantity: 11; Series: M20; REACH SVHC: No SVHC; Color: Black; Lead Pitch: 2.54mm; Max Operating Temperature: 105°C; Orientation: Straight; Radiation Hardening: No; Contact Plating: Tin; Housing Material: Polyamide; Housing Color: Black; Length: 51.2mm; Contact Gender: Female; Number of Positions: 40; Packaging: Rail/Tube; Number of Rows: 2; Material: Glass; Contact Type: Female Socket; Current Rating: 3A; Termination: Solder; Supplier 1: Digi-Key; Manufacturer Part Number: M20-7832046; RoHS: Yes; Category: Headers and Wire Housings; Stock 1: 6647; Pricing 1: 1=3.77000, 11=3.42273, 88=3.01591, 440=2.56348, 946=2.18650, 4906=1.96031 (USD); ComponentLink1URL: https://datasheet.ciiva.com/11748/0900766b80dc1d2a-11748805.pdf?src-supplier=RSComponents; ComponentLink1Description: https://datasheet.ciiva.com/11748/0900766b80dc1d2a-11748805.pdf?src-supplier=RSComponents; ComponentLink2URL: https://datasheet.ciiva.com/26852/getdatasheetpartid-499542-26852174.pdf?src-supplier=Verical; ComponentLink2Description: https://datasheet.ciiva.com/26852/getdatasheetpartid-499542-26852174.pdf?src-supplier=Verical; ComponentLink3URL: https://datasheet.ciiva.com/9479/m20-783-9479864.pdf?src-supplier=Avnet; ComponentLink3Description: https://datasheet.ciiva.com/9479/m20-783-9479864.pdf?src-supplier=Avnet; ComponentLink4URL: https://datasheet.ciiva.com/6795/m20-783-6795342.pdf?src-supplier=Digi-Key; ComponentLink4Description: https://datasheet.ciiva.com/6795/m20-783-6795342.pdf?src-supplier=Digi-Key; ComponentLink5URL: https://datasheet.ciiva.com/7639/1836950-7639737.pdf?src-supplier=Element14; ComponentLink5Description: https://datasheet.ciiva.com/7639/1836950-7639737.pdf?src-supplier=Element14
R3-R19 = CMP-2001-04570-2: RES SMD 0 OHM JUMPER 1/8W 0805; Manufacturer: Yageo; Manufacturer Part Number: RC0805FR-070RL; Resistance: 0Ω; Value: 0Ω; Power Rating: 0.125W; Tolerance: 1%; Voltage Rating: 150V; Max Power Dissipation: 125mW; RoHS: TRUE; Device Class L2: Resistors; Composition: Thick Film; Device Class L1: Passive Components; Height: 0.6mm; Category: Res; Automotive: No; Device Class L3: Chip SMD Resistors; ComponentLink2URL: http://www.yageo.com/documents/recent/PYu-RC_Group_51_RoHS_L_10.pdf; Octopart: https://octopart.com/rc0805fr-070rl-yageo-9293404; Temperature Range High: +155°C; Ipc Land Pattern Name: RESC200125X50; Footprint Url: http://www.yageo.com/exep/pages/download/literatures/PYu-R_Mount_10.pdf; Series: RC_L; Digikey Description: RES SMD 0 OHM JUMPER 1/8W 0805; Temperature Range Low: -55°C; Temperature: -55°C to +155°C; Package: RC0805; ComponentLink2Description: Datasheet; Lead Free: Yes; Supplier 1: Digi-Key; Stock 1: 908367; Pricing 1: 1=0.10000, 10=0.03300, 25=0.02360, 50=0.01800, 100=0.01330, 250=0.01012, 500=0.00810, 1000=0.00597 (USD); Case/Package: 0805; Case Code (Imperial): 0805; Case Code (Metric): 2012; Contact Plating: Tin,Matte; Size Code: 0805; Min Operating Temperature: -55°C; Max Operating Temperature: 155°C; Packaging: Tape and Reel; Resistor Type: Thick Film; Number of Terminations: 2; Construction: Rectangular; Features: Moisture Resistant; Length: 2mm; Depth: 1.25mm; Radiation Hardening: No; RoHS Compliant: Yes; Military Standard: Not; ComponentLink1URL: https://datasheet.ciiva.com/15189/getdatasheetpartid-348154-15189885.pdf?src-supplier=Verical; ComponentLink1Description: https://datasheet.ciiva.com/15189/getdatasheetpartid-348154-15189885.pdf?src-supplier=Verical; ComponentLink3URL: https://datasheet.ciiva.com/17042/rc0805-17042698.pdf?src-supplier=Future+Electronics; ComponentLink3Description: https://datasheet.ciiva.com/17042/rc0805-17042698.pdf?src-supplier=Future+Electronics